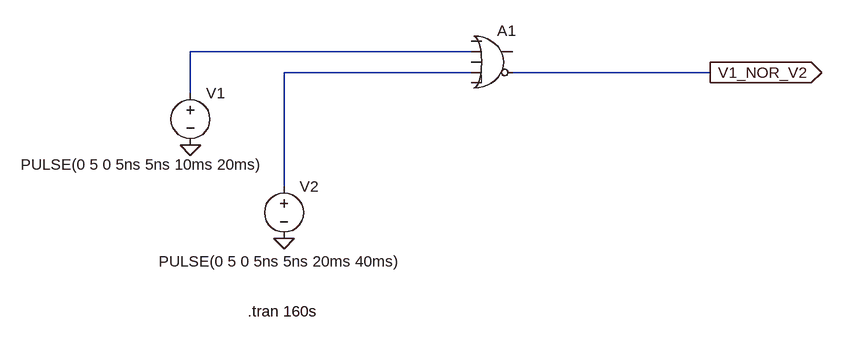
[diagram p0: schematic nor gate.asc]
nor gate.asc, the LTspice schematic file:
Version 4
SHEET 1 968 680
WIRE 400 80 -32 80
WIRE 400 112 112 112
WIRE 768 112 464 112
WIRE -32 144 -32 80
WIRE 112 288 112 112
FLAG -32 224 0
FLAG 112 368 0
FLAG 768 112 V1_NOR_V2
IOPIN 768 112 Out
SYMBOL voltage -32 128 R0
WINDOW 3 -261 126 Left 2
WINDOW 123 0 0 Left 0
WINDOW 39 0 0 Left 0
SYMATTR InstName V1
SYMATTR Value PULSE(0 5 0 5ns 5ns 10ms 20ms)
SYMBOL voltage 112 272 R0
WINDOW 3 -193 131 Left 2
WINDOW 123 0 0 Left 0
WINDOW 39 0 0 Left 0
SYMATTR InstName V2
SYMATTR Value PULSE(0 5 0 5ns 5ns 20ms 40ms)
SYMBOL Digital\\or 432 32 R0
SYMATTR InstName A1
TEXT 56 480 Left 2 !.tran 160s

The netlist it stands for:
* nor gate.asc
V1 N001 0 PULSE(0 5 0 5ns 5ns 10ms 20ms)
V2 N002 0 PULSE(0 5 0 5ns 5ns 20ms 40ms)
A1 0 N001 0 N002 0 V1_NOR_V2 0 0 OR
.tran 160s
.backanno
.end